# EasyEDA Pro project ProPrj_SlimeVR_BMI270_2024-07-19.epro, board PCB1
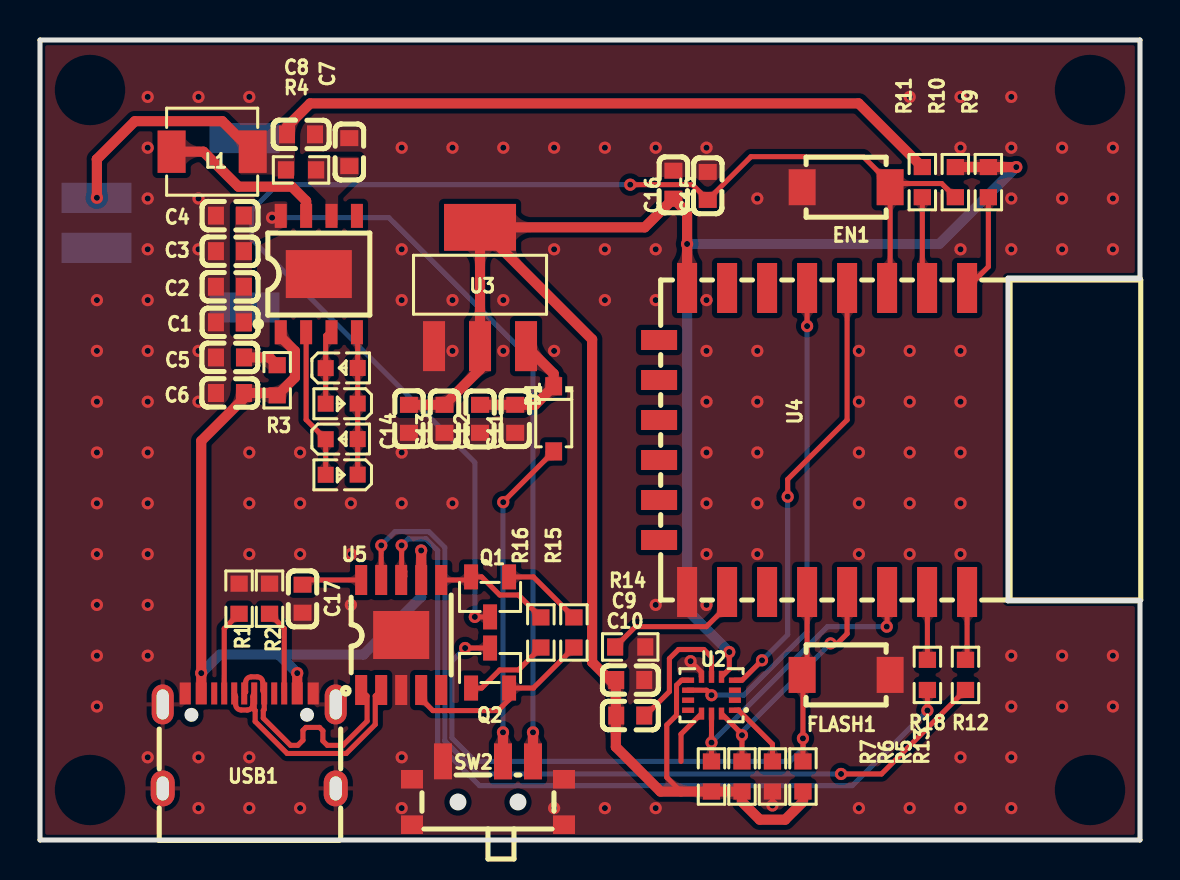
[diagram p4: board, top side]
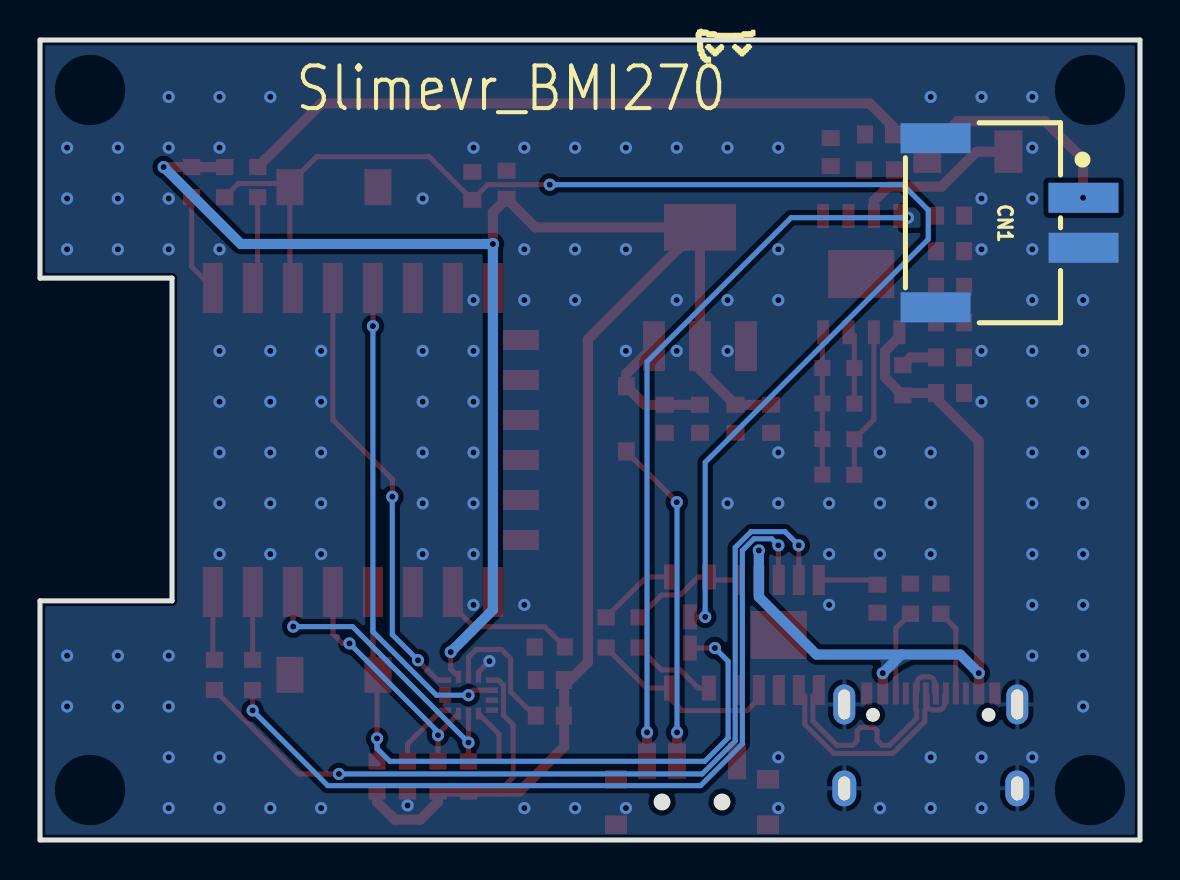
[diagram p5: board, bottom side, seen from below]

Outline 55 x 40 mm; copper layers: Top Layer, Bottom Layer. Coordinates in mm from the lower left corner of the outline.
Outline path: 0,40 0,0 55,0 55,11.96 48.4,11.96 48.4,28.09 55,28.09 55,40 0,40
Stack: Top Layer 0.035mm / Dielectric1 1.51mm FR4 er 4.5 / Bottom Layer 0.035mm

## Design rules (mm)
net D-: DP1
net D+: DP1
template: 自定义配置
spacing copperThickness1oz (default): track to track 0.102, other pairs 0.152 to 0.3
spacing copperThickness2oz: track to track 0.203, other pairs 0.152 to 0.3
track width copperThickness1oz (default): min 0.127, default 0.254, max 2.54
track width copperThickness2oz: min 0.203, default 0.254, max 2.54
differential pair differentialPair (default): width min 0.127, default 0.254, max 2.54; gap min 0.152, default 0.152
via viaSize (default): diameter min 0.5, default 0.61, max 10; hole min 0.3, default 0.305, max 6.3

## Placement (name value [footprint] x y rotation side)
C1  22uF  [C0603]  9.5 25.88 180 top
C2  22uF  [C0603]  9.5 27.66 180 top
C3  22uF  [C0603]  9.5 29.44 180 top
C4  22uF  [C0603]  9.5 31.22 180 top
C5  10uF  [C0603]  9.5 24.13 0 top
C6  10uF  [C0603]  9.5 22.35 0 top
C7  22uF  [C0603]  15.47 34.39 270 top
C8  22uF  [C0603]  13.05 35.28 180 top
C9  100nF  [C0603]  29.51 8 180 top
C10  100nF  [C0603]  29.51 6.22 180 top
C11  10uF  [C0603]  23.76 21.06 270 top
C12  100nF  [C0603]  22 21.06 90 top
C13  100nF  [C0603]  20.22 21.06 90 top
C14  10uF  [C0603]  18.45 21.06 270 top
C15  1uF  [C0603]  33.39 32.7 270 top
C16  100nF  [C0603]  31.67 32.77 90 top
C17  100nF  [C0603]  13.13 12.06 90 top
CN1  ZX-XH2.54-2PWT  [CONN-SMD_2P-P2.54_MEGASTAR_ZX-XH2.54-2PWT]  6.52 30.86 270 bottom
D1  1N4148W  [SOD-123_L3.1-W1.7-LS3.7-RD]  25.69 21.06 270 top
EN1  TS-1185-C-A-A-A  [SW-SMD_L4.0-W3.0-LS5.0-EH]  40.31 32.64 0 top
FLASH1  TS-1185-C-A-A-A  [SW-SMD_L4.0-W3.0-LS5.0-EH]  40.31 8.25 0 top
L1  1uH  [IND-SMD_L4.4-W4.2]  8.61 34.42 180 top
LED1  19-217/GHC-YR1S2/3T  [LED0603-RD]  15.08 18.26 180 top
LED2  NCD0603R1  [LED0603-RD_RED]  15.08 20.04 0 top
LED3  19-217/GHC-YR1S2/3T  [LED0603-RD]  15.08 21.82 180 top
LED4  NCD0603R1  [LED0603-RD_RED]  15.08 23.6 0 top
Q1  S8050  [SOT-23-3_L2.9-W1.3-P1.90-LS2.4-BR]  22.5 12.15 90 top
Q2  S8050  [SOT-23-3_L2.9-W1.3-P1.90-LS2.4-BR]  22.5 8.6 270 top
R1  5.1kΩ  [R0603]  9.95 12.06 90 top
R2  5.1kΩ  [R0603]  11.48 12.06 90 top
R3  2Ω  [R0603]  11.86 22.99 90 top
R4  500mΩ  [R0603]  13.05 33.5 180 top
R5  10K  [R0603]  36.62 3.17 90 top
R6  10K  [R0603]  35.1 3.17 270 top
R7  10K  [R0603]  33.57 3.17 270 top
R9  10kΩ  [R0603]  47.42 32.89 90 top
R10  10kΩ  [R0603]  45.77 32.89 90 top
R11  180kΩ  [R0603]  44.12 32.89 270 top
R12  0Ω  [R0603]  46.28 8.25 270 top
R13  10kΩ  [R0603]  38.15 3.17 270 top
R14  10kΩ  [R0603]  29.51 9.65 180 top
R15  10kΩ  [R0603]  26.69 10.38 90 top
R16  10kΩ  [R0603]  25.04 10.38 270 top
R18  0Ω  [R0603]  44.37 8.25 270 top
SW2  MK-12C02-G025  [SW-SMD_MK-12C02-G025]  22.4 2.35 0 top
U1  IP5306  [ESOP-8_L4.9-W3.9-P1.27-LS6.0-BL-EP]  13.94 28.3 0 top
U2  BMI270  [LGA-14_L3.0-W2.5-P0.50-BR]  33.57 7.24 0 top
U3  AMS1117-3.3  [SOT-223-3_L6.5-W3.4-P2.30-LS7.0-BR]  22 27.66 270 top
U4  WT8266-S5 ESP-12F  [WIRELM-SMD_WT8266-S5-ESP-12F]  38.66 20 270 top
U5  CH340K  [ESOP-10_L4.9-W3.9-P1.00-LS6.2-BL-EP]  18.06 10.25 0 top
USB1  TYPE-C 16PIN 2MD(073)  [USB-C-SMD_TYPE-C-6PIN-2MD-073]  10.46 4.95 0 top

## Footprints (pads in the part's own frame, mm; a bottom-side part is the same pattern mirrored in y, then rotated)
C0603
  rect 0.8x0.9 smd: 1(-0.7,0) 2(0.7,0)
CONN-SMD_2P-P2.54_MEGASTAR_ZX-XH2.54-2PWT
  rect 1.5x3.5 smd: 1(-1.25,3.7) 2(1.25,3.7) 3(-4.23,-3.7) 4(4.23,-3.7)
ESOP-8_L4.9-W3.9-P1.27-LS6.0-BL-EP
  rect 0.6x1.2 smd: 1(-1.905,-2.909) 2(-0.635,-2.909) 3(0.635,-2.909) 4(1.905,-2.909) 5(1.905,2.909) 6(0.635,2.909) 7(-0.635,2.909) 8(-1.905,2.909)
  rect 3.3x2.4 smd: 9(0,0)
ESOP-10_L4.9-W3.9-P1.00-LS6.2-BL-EP
  rect 0.6x1.5 smd: 1(-2,-2.75) 2(-1,-2.75) 3(0,-2.75) 4(1,-2.75) 5(2,-2.75) 6(2,2.75) 7(1,2.75) 8(0,2.75) 9(-1,2.75) 10(-2,2.75)
  rect 2.8x2.4 smd: 11(0,0)
IND-SMD_L4.4-W4.2
  rect 1.4x2.12 smd: 1(2.028,0) 2(-2.028,0)
LED0603-RD
  rect 0.8x0.8 smd: 1(-0.799,-0.004) 2(0.799,0.004)
LED0603-RD_RED
  rect 0.8x0.8 smd: 1(-0.799,-0.004) 2(0.799,0.004)
LGA-14_L3.0-W2.5-P0.50-BR
  rect 0.6x0.27 smd: 1(1.17,-0.75) 2(1.17,-0.25) 3(1.17,0.25) 4(1.17,0.75) 8(-1.17,0.75) 9(-1.17,0.25) 10(-1.17,-0.25) 11(-1.17,-0.75)
  rect 0.27x0.6 smd: 5(0.5,0.92) 6(0,0.92) 7(-0.5,0.92) 12(-0.5,-0.92) 13(0,-0.92) 14(0.5,-0.92)
R0603
  rect 0.806x0.864 smd: 1(-0.753,0) 2(0.753,0)
SOD-123_L3.1-W1.7-LS3.7-RD
  rect 0.91x0.84 smd: 1(-1.63,0) 2(1.63,0)
SOT-23-3_L2.9-W1.3-P1.90-LS2.4-BR
  rect 1.25x0.7 smd: 1(1,-0.95) 2(1,0.95) 3(-1,0)
SOT-223-3_L6.5-W3.4-P2.30-LS7.0-BR
  rect 2.5x1.1 smd: 1(2.97,-2.3) 2(2.97,0) 3(2.97,2.3)
  rect 2.34x3.6 smd: 4(-2.97,0)
SW-SMD_L4.0-W3.0-LS5.0-EH
  rect 1.35x1.8 smd: 1(-2.2,0) 2(2.2,0)
SW-SMD_MK-12C02-G025
  rect 0.9x1.8 smd: 1(-2.25,1.583) 2(0.75,1.583) 3(2.25,1.583)
  rect 1.1x0.93 smd: 4(3.8,0.686) 5(3.8,-1.583) 6(-3.8,-1.583) 7(-3.8,0.686)
USB-C-SMD_TYPE-C-6PIN-2MD-073
  rect 0.55x1.1 smd: 1(-3.2,2.375) 2(-2.4,2.375) 11(2.4,2.375) 12(3.2,2.375)
  rect 0.3x1.1 smd: 3(-1.75,2.375) 4(-1.25,2.375) 5(-0.75,2.375) 6(-0.25,2.375) 7(0.25,2.375) 8(0.75,2.375) 9(1.25,2.375) 10(1.75,2.375)
  oval 1.1x2 hole 0.6x1.5: 13(-4.325,1.825) 14(4.325,1.825)
  oval 1.2x1.8 hole 0.6x1.2: 13(-4.325,-2.375) 14(4.325,-2.375)
WIRELM-SMD_WT8266-S5-ESP-12F
  rect 2.5x1 smd: 1(-7.6,7.7) 2(-7.6,5.7) 3(-7.6,3.7) 4(-7.6,1.7) 5(-7.6,-0.3) 6(-7.6,-2.3) 7(-7.6,-4.3) 8(-7.6,-6.3) 9(7.6,-6.3) 10(7.6,-4.3) 11(7.6,-2.3) 12(7.6,-0.3) 13(7.6,1.7) 14(7.6,3.7) 15(7.6,5.7) 16(7.6,7.7)
  rect 1x1.8 smd: 17(-5,-7.7) 18(-3,-7.7) 19(-1,-7.7) 20(1,-7.7) 21(3,-7.7) 22(5,-7.7)

## Nets
As in the schematic.

Pads without a net: U1 5; U2 2 3 10 11 12; U4 6 7 11 17 18 19 20 21 22; U5 5; USB1 3 9

## Via types
v1: diameter 0.61, hole 0.305, Top Layer to Bottom Layer, 153 vias

## Routing (per net, layer and track width the routed paths; a pad name or vN(x,y) marks a point on that pad's centre or on a via; arc(x,y) is an arc through that point)
3V3: length 117.6
  Top Layer w0.254: v1(34.46,9.4) 34.46,8.55 U2.5 ; 32.05,2.42 31.34,3.13 31.34,5.75 31.83,6.24 31.83,7.74 32.08,7.99 U2.8
  Top Layer w0.508: U3.4 27.61,25.03 27.61,8.89 28.62,7.87 28.79,7.87 28.79,4.66 31.03,2.42 R7.2 R6.2 35.1,1.91 35.99,1.02 37.26,1.02 38.15,1.91 R13.2 ; U3.4 22,23.54 C13.2 C14.1 ; U3.4 30.24,30.63 C16.1 32.35,31.38 v1(32.35,29.8) U4.8 ; R10.2 R9.2 v1(48.81,33.65)
  Bottom Layer w0.508: 48.81,33.66 44.96,29.8 v1(32.35,29.8) 32.35,11.51 v1(34.46,9.4)
5V: length 35.8
  Top Layer w0.508: 24.65,4.11 v1(24.65,5.38)
  Bottom Layer w0.254: v1(11.6,31.11) 17.45,31.11 24.65,23.91 v1(24.65,5.38)
GND: length 1.7
  Top Layer w0.254: R5.1 v1(36.62,1.73) ; U2.7 33.07,8.17 33.07,8.4 v1(32.53,8.94)
  vias: v1(2.84,27) v1(2.84,24.45) v1(2.84,21.92) v1(2.84,19.38) v1(2.84,16.83) v1(2.84,14.3) v1(2.84,11.75) v1(2.84,9.22) v1(2.84,6.67) v1(5.38,37.16) v1(5.38,34.61) v1(5.38,32.08) v1(5.38,29.53) v1(5.38,27) v1(5.38,24.45) v1(5.38,21.92) v1(5.38,19.38) v1(5.38,16.83) v1(5.38,14.3) v1(5.38,11.75) v1(5.38,9.22) v1(5.38,4.14) v1(7.93,37.16) v1(7.93,32.08) v1(7.93,29.53) v1(7.93,24.45) v1(7.93,21.92) v1(7.93,4.14) v1(7.93,1.59) v1(10.47,37.16) v1(10.47,19.38) v1(10.47,16.83) v1(10.47,14.3) v1(10.47,4.14) v1(10.47,1.59) v1(13,19.38) v1(13,16.83) v1(13,14.3) v1(13,1.59) v1(15.54,16.83) v1(15.54,14.3) v1(15.54,11.75) v1(18.09,34.61) v1(18.09,29.53) v1(18.09,27) v1(18.09,19.38) v1(18.09,16.83) v1(18.09,4.14) v1(18.09,1.59) v1(20.62,34.61) v1(20.62,27) v1(20.62,24.45) v1(20.62,16.83) v1(23.16,34.61) v1(23.16,27) v1(23.16,24.45) v1(25.71,34.61) v1(25.71,29.53) v1(25.71,24.45) v1(25.71,1.59) v1(28.25,34.61) v1(28.25,29.53) v1(28.25,27) v1(28.25,1.59) v1(30.78,34.61) v1(30.78,29.53) v1(30.78,27) v1(30.78,11.75) v1(30.78,1.59) v1(33.32,34.61) v1(33.32,27) v1(33.32,24.45) v1(33.32,21.92) v1(33.32,19.38) v1(33.32,16.83) v1(33.32,14.3) v1(33.32,11.75) v1(35.87,32.08) v1(35.87,24.45) v1(35.87,21.92) v1(35.87,19.38) v1(35.87,16.83) v1(35.87,14.3) v1(40.94,24.45) v1(40.94,21.92) v1(40.94,19.38) v1(40.94,16.83) v1(40.94,14.3) v1(40.94,1.59) v1(43.49,37.16) v1(43.49,24.45) v1(43.49,21.92) v1(43.49,19.38) v1(43.49,16.83) v1(43.49,14.3) v1(43.49,1.59) v1(46.03,37.16) v1(46.03,34.61) v1(46.03,29.53) v1(46.03,24.45) v1(46.03,21.92) v1(46.03,19.38) v1(46.03,16.83) v1(46.03,14.3) v1(46.03,4.14) v1(46.03,1.59) v1(48.56,37.16) v1(48.56,34.61) v1(48.56,32.08) v1(48.56,29.53) v1(48.56,9.22) v1(48.56,6.67) v1(48.56,4.14) v1(48.56,1.59) v1(51.1,34.61) v1(51.1,32.08) v1(51.1,29.53) v1(51.1,9.22) v1(51.1,6.67) v1(53.65,34.61) v1(53.65,32.08) v1(53.65,29.53) v1(53.65,9.22) v1(53.65,6.67)
VBAT: length 45.1
  Top Layer w0.508: R11.1 40.93,36.83 13.51,36.83 12.35,35.67 C8.2 ; L1.2 9.11,35.94 4.75,35.94 2.84,34.04 2.84,34.03 v1(2.84,32.11)
VBUS: length 40.7
  Top Layer w0.508: 12.04,25.52 12.04,25.16 12.75,24.45 12.75,23.12 R3.1 11.74,22.35 C6.2 10.2,22.09 8.06,19.95 v1(8.06,8.34) USB1.2 ; 19.06,12.55 v1(19.06,14.48) ; 12.86,7.33 v1(12.86,8.34)
  Bottom Layer w0.508: 11.93,9.27 v1(12.86,8.34) ; 11.93,9.27 16.18,9.27 19.06,12.15 v1(19.06,14.48) ; 11.93,9.27 8.99,9.27 v1(8.06,8.34)
(no net): length 2.8
  Top Layer w0.254: 32.05,3.93 32.05,5.3 U2.12
CH340_RXD: length 43.7
  Top Layer w0.254: v1(40.05,3.3) 42.08,3.3 R12.2 ; v1(17.06,14.73) 17.06,14.73 U5.9
  Bottom Layer w0.254: v1(17.06,14.73) 17.75,15.42 19.45,15.42 20.24,14.62 20.24,4.95 21.89,3.3 v1(40.05,3.3)
CH340_TXD: length 41.7
  Top Layer w0.254: v1(44.37,6.48) R18.2 ; v1(18.08,14.73) 18.08,13.59 18.24,13.43 18.24,13.18 U5.8
  Bottom Layer w0.254: v1(44.37,6.48) 40.61,2.72 21.97,2.72 19.88,4.81 19.88,14.48 19.3,15.06 18.41,15.06 v1(18.08,14.73)
D+: length 12.8
  Top Layer w0.254: U5.1 16.35,7.2 16.35,5.94 15.14,4.73 14.37,4.73 14.14,4.96 14.14,5.46 13.98,5.63 13.3,5.63 13.15,5.48 13.15,4.99 12.89,4.73 12.53,4.73 11.16,6.09 11.16,6.48 11.21,6.52 USB1.8 arc(11.16,7.41) 11.14,7.5 11.14,7.88 arc(11.06,8.08) 10.86,8.16 10.56,8.16 arc(10.36,8.08) 10.28,7.88 10.28,7.4 arc(10.28,7.4) 10.28,7.4 USB1.6
D-: length 12.8
  Top Layer w0.254: U5.2 16.76,7.2 16.76,5.78 15.31,4.33 12.36,4.33 10.76,5.93 10.76,6.48 10.71,6.52 USB1.7 arc(10.66,7.25) 10.64,7.16 10.64,6.78 arc(10.56,6.58) 10.36,6.5 10.06,6.5 arc(9.86,6.58) 9.78,6.78 9.78,7.16 arc(9.76,7.25) USB1.5
DTR: length 10
  Top Layer w0.254: U5.4 19.06,7.06 19.64,6.47 22.9,6.47 23.45,7.02 Q2.2 24.67,7.6 26.69,9.62
EN: length 68.6
  Top Layer w0.254: Q1.3 v1(21.74,11.15) ; EN1.2 42.51,27.75 U4.3 ; R10.1 45.09,32.82 42.51,32.82 41.16,34.17 35.55,34.17 C15.2 32.62,32.77 v1(29.51,32.77)
  Bottom Layer w0.254: v1(21.74,11.15) 21.74,18.88 10.59,30.03 10.59,31.5 11.86,32.77 v1(29.51,32.77)
INT1: length 22.1
  Top Layer w0.254: v1(37.38,17.17) 37.38,18.03 40.35,21 U4.4 ; v1(36.1,8.99) 35.1,7.99 U2.4
  Bottom Layer w0.254: v1(36.1,8.99) 37.38,10.27 v1(37.38,17.17)
INT2: length 24.6
  Top Layer w0.254: U2.9 33.32,7.49 v1(33.57,7.24) ; v1(38.35,25.69) U4.5
  Bottom Layer w0.254: v1(33.57,7.24) 35.18,7.24 38.35,10.41 v1(38.35,25.69)
IO0: length 33.1
  Top Layer w0.254: R13.1 v1(38.15,5.08) 38.15,7.83 ; Q2.3 v1(21.26,9.6) ; FLASH1.1 38.15,8.21 38.35,8.42 U4.12
  Bottom Layer w0.254: v1(21.26,9.6) 20.6,8.94 20.6,5.1 21.76,3.94 37.51,3.94 38.15,4.57 v1(38.15,5.08)
RTS: length 5.9
  Top Layer w0.254: R16.1 23.92,12.25 22.99,12.25 22.08,13.15 Q1.2 21.4,13 U5.6
SCL: length 15.3
  Top Layer w0.254: U2.13 v1(33.57,4.87) R7.1 ; U4.14 42.35,10.69 v1(42.34,10.67)
  Bottom Layer w0.254: v1(33.57,4.87) 39.37,10.67 v1(42.34,10.67)
SDA: length 12.4
  Top Layer w0.254: v1(39.53,9.83) 39.87,9.83 40.35,10.31 U4.13 ; R6.1 v1(35.1,5.24) 35.1,5.3 U2.14
  Bottom Layer w0.254: v1(35.1,5.24) 35.1,5.4 v1(39.53,9.83)
SW: length 16.4
  Top Layer w0.254: D1.2 23.16,16.91 v1(23.16,16.89)
  Top Layer w0.508: 23.15,4.11 v1(23.15,5.38)
  Bottom Layer w0.254: v1(23.16,16.89) 23.15,16.88 v1(23.15,5.38)
$1N315: length 4.3
  Top Layer w0.254: USB1.10 12.21,10.58 R2.1
$1N353: length 4.3
  Top Layer w0.254: USB1.4 9.21,10.57 R1.1
$1N1430: length 1.8
  Top Layer w0.508: C5.2 11.47,24.13 R3.2
$1N1434: length 8.4
  Top Layer w0.508: 13.31,31.33 13.31,31.95 12.59,32.67 9.92,32.67 8.17,34.42 L1.1
$1N1435: length 0.3
  Top Layer w0.508: 13.81,33.5 13.93,33.38 13.81,33.38
$1N1807: length 7.7
  Top Layer w0.254: LED1.2 14.28,20.04 13.31,21.02 13.31,25.52
$1N1813: length 3.8
  Top Layer w0.254: 14.58,25.52 14.28,25.22 LED3.2
$1N1819: length 7.3
  Top Layer w0.254: LED1.1 LED2.2 LED3.1 LED4.2 15.88,25.48 15.85,25.52
$1N2144: length 6.6
  Top Layer w0.508: C11.1 24.76,21.76 D1.1 25.69,23.31 U3.3 ; 23.76,21.76 C12.2
$1N4879: length 3.4
  Top Layer w0.254: U2.1 34.93,6.49 36.62,4.79 R5.2
$1N4904: length 6.8
  Top Layer w0.254: U2.6 33.57,9.14 33.19,9.53 31.92,9.53 31.47,9.07 31.47,7.42 30.27,6.22 30.21,6.22
$1N5427: length 4.3
  Top Layer w0.254: Q2.1 22.08,7.6 22.99,8.5 23.92,8.5 25.04,9.62
$1N5432: length 4.1
  Top Layer w0.254: Q1.1 24.67,13.15 R15.2
$1N5994: length 7.1
  Top Layer w0.254: R14.2 29.77,10.67 33.32,10.67 34.35,11.7 U4.10
$1N6007: length 5
  Top Layer w0.254: R9.1 47.42,28.66 U4.1
$1N6011: length 4.6
  Top Layer w0.254: R11.2 44.12,27.84 U4.2
$1N6193: length 3.4
  Top Layer w0.254: U4.16 46.35,9.09 R12.1
$1N6195: length 3.4
  Top Layer w0.254: U4.15 44.37,12.39 R18.1
$1N6282: length 3
  Top Layer w0.254: U5.10 13.36,13 C17.2

## Copper pours and planes (outline as drawn; the poured copper is in the pictures)
5V on Top Layer: 11.73,31.93 12.37,31.93 12.37,30.71 10.59,29.83 10.59,25.39 9.75,25.39 9.75,31.68 10.59,31.68
GND on Top Layer: 0.05,40 55,40 55,0 0.05,0
GND on Bottom Layer: 0.05,40 55,40 55,0 0.05,0
VBAT on Top Layer: 9.95,35.43 9.95,33.27 11.64,33.27 11.86,33.05 12.75,33.05 12.75,35.74 11.66,35.74 11.35,35.43
$1N1435 on Top Layer: 14.27,30.73 14.27,32 13.38,32.89 13.38,34.04 13.38,34.16 15.96,34.16 15.96,33.26 14.91,32.21 14.91,30.73

Small or netless copper shapes (teardrops, artwork), in the pictures only: 151 on Top Layer, 25 on Bottom Layer

## Text on the board
Bottom Silkscreen Layer: Slimevr_BMI270
